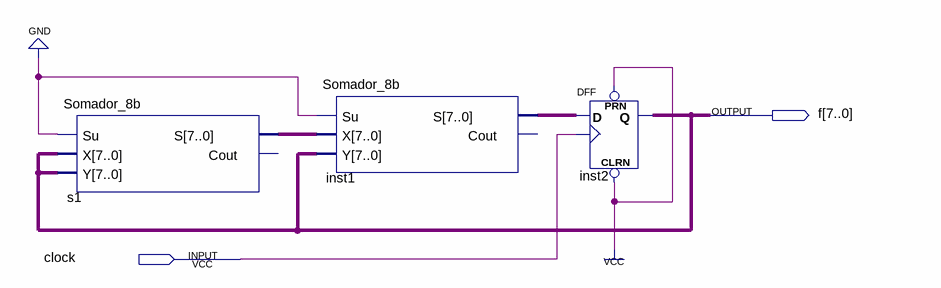
[diagram p0: schematic sheet]
// Quartus schematic Questao08.bdf as structural Verilog: 3 symbols, 2 pins
module Questao08 (
  input  clock,
  output [7:0] f
);

  wire [7:0] inst1_s, s1_s;

  Somador_8b s1 (.Su(1'b0), .X(f), .Y(f), .S(s1_s));  // open: Cout
  Somador_8b inst1 (.Su(1'b0), .X(s1_s), .Y(f), .S(inst1_s));  // open: Cout
  DFF inst2[7:0] (.CLRN(1'b1), .CLK(clock), .D(inst1_s), .PRN(1'b1), .Q(f));
endmodule
